# EAGLE design Adaptable AVR Programmer (EAGLE 5.06)
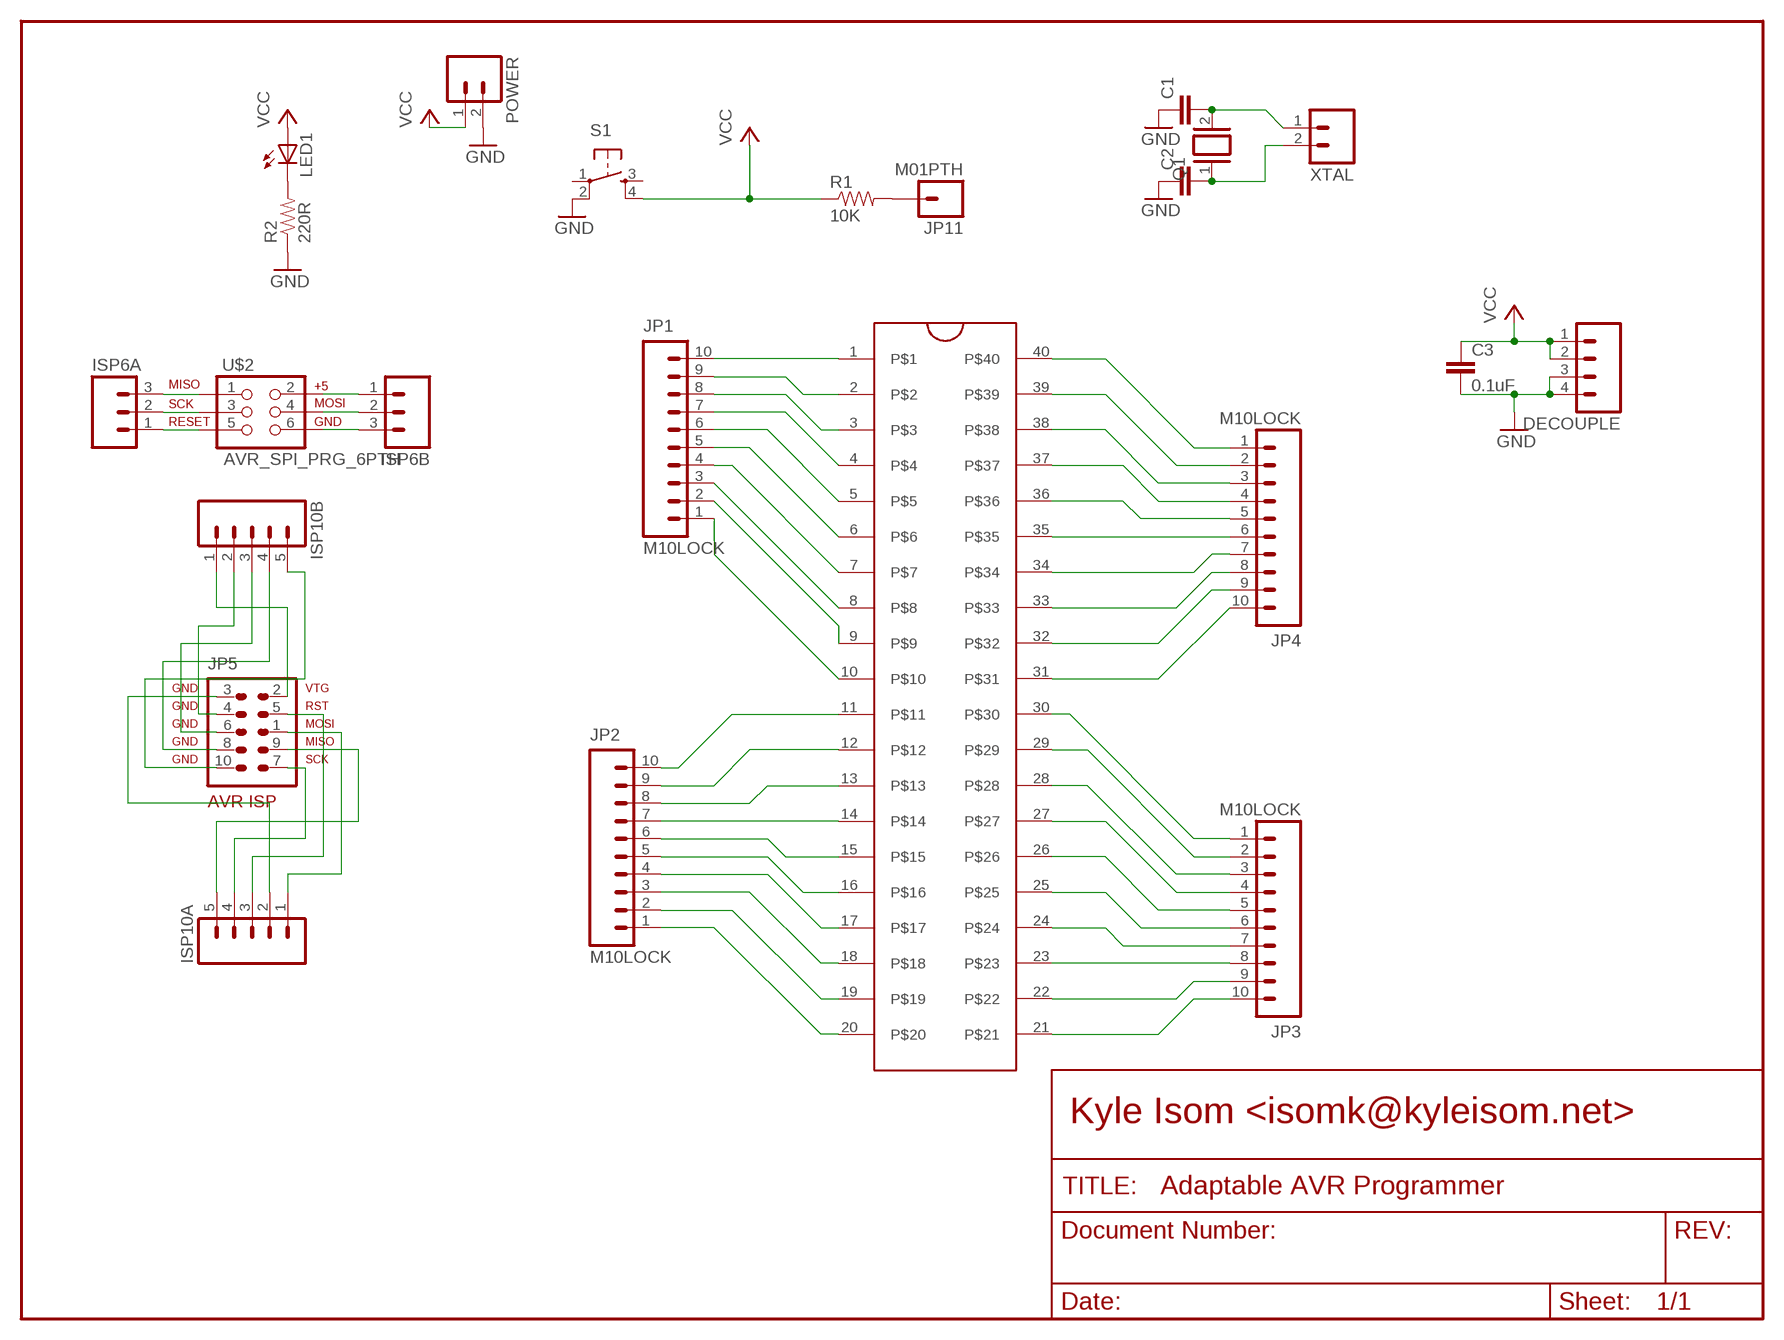
[diagram p0: schematic, sheet 1]

## Parts
C1  CAPPTH1  [CAP-PTH-5MM]
C2  CAPPTH1  [CAP-PTH-5MM]
C3  0.1uF  CAPPTH1  [CAP-PTH-5MM]
DECOUPLE  M04LOCK  [1X04_LOCK]
ISP6A  M03LOCK  [1X03_LOCK]
ISP6B  M03LOCK  [1X03_LOCK]
ISP10A  M05LOCK  [1X05_LOCK]
ISP10B  M05LOCK  [1X05_LOCK]
JP1  M10LOCK  [1X10_LOCK]
JP2  M10LOCK  [1X10_LOCK]
JP3  M10LOCK  [1X10_LOCK]
JP4  M10LOCK  [1X10_LOCK]
JP5  AVR-ISP-10  [AVR-ISP-10]
JP11  M01PTH  [1X01]
LED1  LED3MM  [LED3MM]
POWER  M02LOCK  [1X02_LOCK]
Q1  XTAL/S  [QS]
R1  10K  RESISTORPTH1  [AXIAL-0.3]
R2  220R  RESISTORPTH1  [AXIAL-0.3]
S1  TAC_SWITCHPTH  [TACTILE-PTH]
U$1  ZIFSOCKET-40-6DIL40-6-ZIF_SOCKET  [DIL40-6-ZIF_SOCKET]
U$2  AVR_SPI_PRG_6PTH  [2X3]
XTAL  M02LOCK  [1X02_LOCK]

## Nets
GND: C1.1 C2.1 C3.2 DECOUPLE.3 DECOUPLE.4 POWER.2 R2.P$1 S1.2
N$1: JP1.10 U$1.1
N$2: JP1.9 U$1.2
N$3: JP1.8 U$1.3
N$4: JP1.7 U$1.4
N$5: JP1.6 U$1.5
N$6: JP1.5 U$1.6
N$7: JP1.4 U$1.7
N$8: JP1.3 U$1.8
N$9: JP1.2 U$1.9
N$10: JP1.1 U$1.10
N$11: JP2.10 U$1.11
N$12: JP2.9 U$1.12
N$13: LED1.K(C) R2.P$2
N$14: JP2.8 U$1.13
N$15: JP2.7 U$1.14
N$16: JP2.6 U$1.15
N$17: JP2.5 U$1.16
N$18: JP2.4 U$1.17
N$19: JP2.3 U$1.18
N$20: JP2.2 U$1.19
N$21: JP2.1 U$1.20
N$22: JP3.10 U$1.21
N$23: JP3.9 U$1.22
N$24: JP3.8 U$1.23
N$25: JP3.7 U$1.24
N$26: JP3.6 U$1.25
N$27: JP3.5 U$1.26
N$28: JP3.4 U$1.27
N$29: JP3.3 U$1.28
N$30: JP3.2 U$1.29
N$31: JP3.1 U$1.30
N$32: JP4.10 U$1.31
N$33: JP4.9 U$1.32
N$34: JP4.8 U$1.33
N$35: JP4.7 U$1.34
N$36: JP4.6 U$1.35
N$37: JP4.5 U$1.36
N$38: JP4.4 U$1.37
N$39: JP4.3 U$1.38
N$40: JP4.2 U$1.39
N$41: JP4.1 U$1.40
N$42: ISP6B.1 U$2.2
N$43: ISP6B.2 U$2.4
N$44: ISP6B.3 U$2.6
N$45: ISP6A.1 U$2.5
N$46: ISP6A.2 U$2.3
N$47: ISP6A.3 U$2.1
N$48: ISP10B.1 JP5.2
N$49: ISP10B.2 JP5.4
N$50: ISP10B.3 JP5.6
N$51: ISP10B.4 JP5.8
N$52: ISP10B.5 JP5.10
N$53: ISP10A.1 JP5.1
N$54: ISP10A.2 JP5.3
N$55: JP11.1 R1.P$2
N$57: C1.2 Q1.2 XTAL.1
N$58: C2.2 Q1.1 XTAL.2
N$59: ISP10A.3 JP5.5
N$60: ISP10A.4 JP5.7
N$61: ISP10A.5 JP5.9
VCC: C3.1 DECOUPLE.1 DECOUPLE.2 LED1.A POWER.1 R1.P$1 S1.4
Unconnected: S1.1 S1.3

## Notes on the sheet
- Kyle Isom <isomk@kyleisom.net>

## Library data of the parts
C1-C3 = SparkFun:CAP: Capacitor Standard 0603 ceramic capacitor, and 0.1" leaded capacitor.
DECOUPLE = SparkFun:M04: Header 4 Standard 4-pin 0.1" header. Use with straight break away headers (SKU : PRT-00116), right angle break away headers (PRT-00553), swiss pins (PRT-00743), machine pins (PRT-00117), and female headers (PRT-00115). Molex polarized connector foot print use with SKU : PRT-08231 with associated crimp pins and housings.
ISP6A ISP6B = SparkFun:M03: Header 3 Standard 3-pin 0.1" header. Use with straight break away headers (SKU : PRT-00116), right angle break away headers (PRT-00553), swiss pins (PRT-00743), machine pins (PRT-00117), and female headers (PRT-00115). Molex polarized connector foot print use with SKU : PRT-08232 with associated crimp pins and housings.
ISP10A ISP10B = SparkFun:M05: Header 5 Standard 5-pin 0.1" header. Use with straight break away headers (SKU : PRT-00116), right angle break away headers (PRT-00553), swiss pins (PRT-00743), machine pins (PRT-00117), and female headers (PRT-00115). Molex polarized connector foot print use with SKU : PRT-08230 with associated crimp pins and housings.
JP1-JP4 = SparkFun:M10: Header 10 Standard 10-pin 0.1" header. Use with straight break away headers (SKU : PRT-00116), right angle break away headers (PRT-00553), swiss pins (PRT-00743), machine pins (PRT-00117), and female headers (PRT-00115).
JP5 = avr-6:AVR-ISP-10: AVR ISP-10 Serial Programming Header
JP11 = SparkFun:M01: Header 1 Standard 1-pin 0.1" header. Use with straight break away headers (SKU : PRT-00116), right angle break away headers (PRT-00553), swiss pins (PRT-00743), machine pins (PRT-00117), and female headers (PRT-00115).
LED1 = led:LED: LED OSRAM: - CHIPLED LG R971, LG N971, LY N971, LG Q971, LY Q971, LO R971, LY R971 LH N974, LH R974 LS Q976, LO Q976, LY Q976 LO Q996 - Hyper CHIPLED LW Q18S LB Q993, LB Q99A, LB R99A - SideLED LS A670, LO A670, LY A670, LG A670, LP A670 LB A673, LV A673, LT A673, LW A673 LH A674 LY A675 LS A676, LA A676, LO A676, LY A676, LW A676 LS A679, LY A679, LG A679 - Hyper Micro SIDELED® LS Y876, LA Y876, LO Y876, LY Y876 LT Y87S - SmartLED LW L88C, LW L88S LB L89C, LB L89S, LG L890 LS L89K, LO L89K, LY L89K LS L896, LA L896, LO L896, LY L896 - TOPLED LS T670, LO T670, LY T670, LG T670, LP T670 LSG T670, LSP T670, LSY T670, LOP T670, LYG T670 LG T671, LOG T671, LSG T671 LB T673, LV T673, LT T673, LW T673 LH T674 LS T676, LA T676, LO T676, LY T676, LB T676, LH T676, LSB T676, LW T676 LB T67C, LV T67C, LT T67C, LS T67K, LO T67K, LY T67K, LW E67C LS E67B, LA E67B, LO E67B, LY E67B, LB E67C, LV E67C, LT E67C LW T67C LS T679, LY T679, LG T679 LS T770, LO T770, LY T770, LG T770, LP T770 LB T773, LV T773, LT T773, LW T773 LH T774 LS E675, LA E675, LY E675, LS T675 LS T776, LA T776, LO T776, LY T776, LB T776 LHGB T686 LT T68C, LB T68C - Hyper Mini TOPLED® LB M676 - Mini TOPLED Santana® LG M470 LS M47K, LO M47K, LY M47K Source: http://www.osram.convergy.de LUXEON: - LUMILED® LXK2-PW12-R00, LXK2-PW12-S00, LXK2-PW14-U00, LXK2-PW14-V00 LXK2-PM12-R00, LXK2-PM12-S00, LXK2-PM14-U00 LXK2-PE12-Q00, LXK2-PE12-R00, LXK2-PE12-S00, LXK2-PE14-T00, LXK2-PE14-U00 LXK2-PB12-K00, LXK2-PB12-L00, LXK2-PB12-M00, LXK2-PB14-N00, LXK2-PB14-P00, LXK2-PB14-Q00 LXK2-PR12-L00, LXK2-PR12-M00, LXK2-PR14-Q00, LXK2-PR14-R00 LXK2-PD12-Q00, LXK2-PD12-R00, LXK2-PD12-S00 LXK2-PH12-R00, LXK2-PH12-S00 LXK2-PL12-P00, LXK2-PL12-Q00, LXK2-PL12-R00 Source: www.luxeon.com KINGBRIGHT: KA-3528ASYC Source: www.kingbright.com
POWER XTAL = SparkFun:M02: Header 2 Standard 2-pin 0.1" header. Use with straight break away headers (SKU : PRT-00116), right angle break away headers (PRT-00553), swiss pins (PRT-00743), machine pins (PRT-00117), and female headers (PRT-00115). Molex polarized connector foot print use with SKU : PRT-08233 with associated crimp pins and housings.
Q1 = special:XTAL/S: CRYSTAL
R1 R2 = SparkFun:RESISTOR: Resistor Basic schematic elements and footprints for 0603, 1206, and PTH 1/10th watt (small) resistors.
S1 = SparkFun:TAC_SWITCH: Momentary Switch Button commonly used for reset or general input. Spark Fun Electronics SKU : COM-00097
U$1 = SparkFun:ZIFSOCKET-40-6
U$2 = SparkFun:AVR_SPI_PRG_6: AVR ISP 6 Pin This is the reduced ISP connector for AVR programming. Common on Arduino. This footprint will take up less PCB space and can be used with a 10-pin to 6-pin adapter such as SKU: BOB-08508

## Board
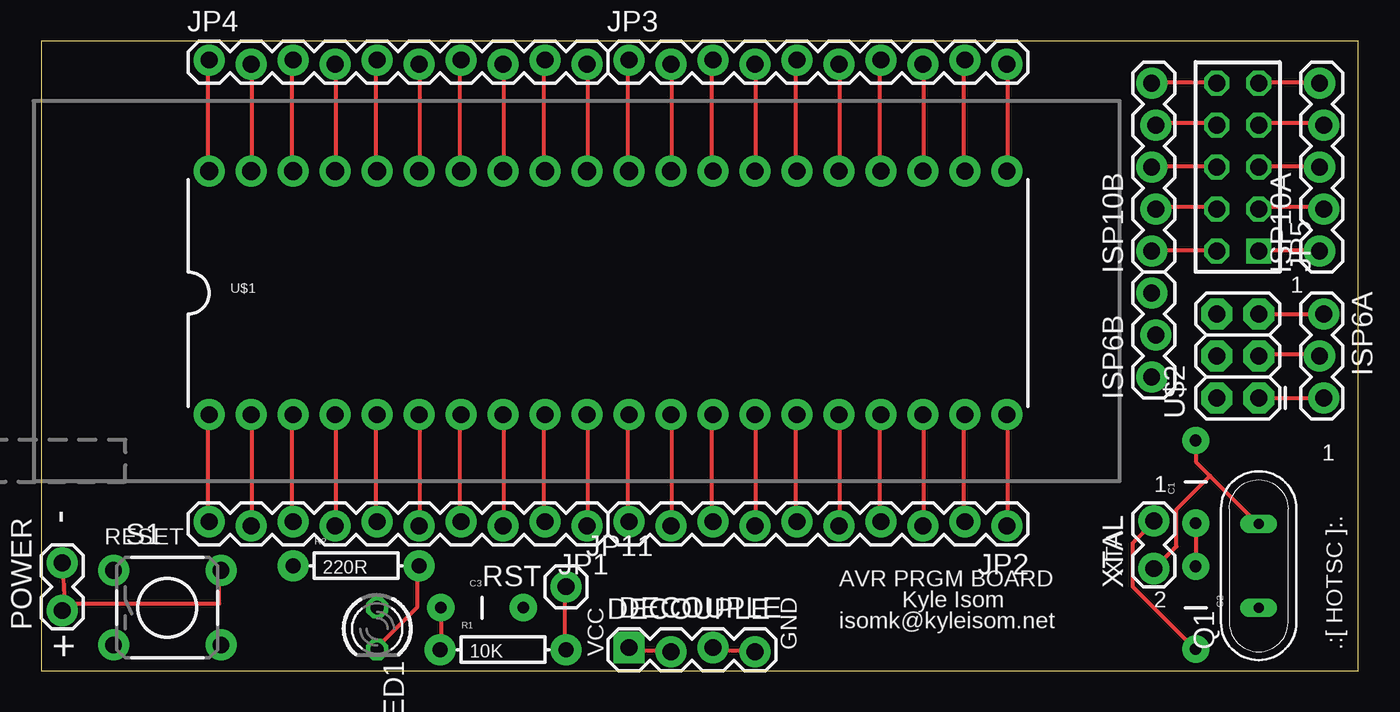
[diagram p1: board, top side]
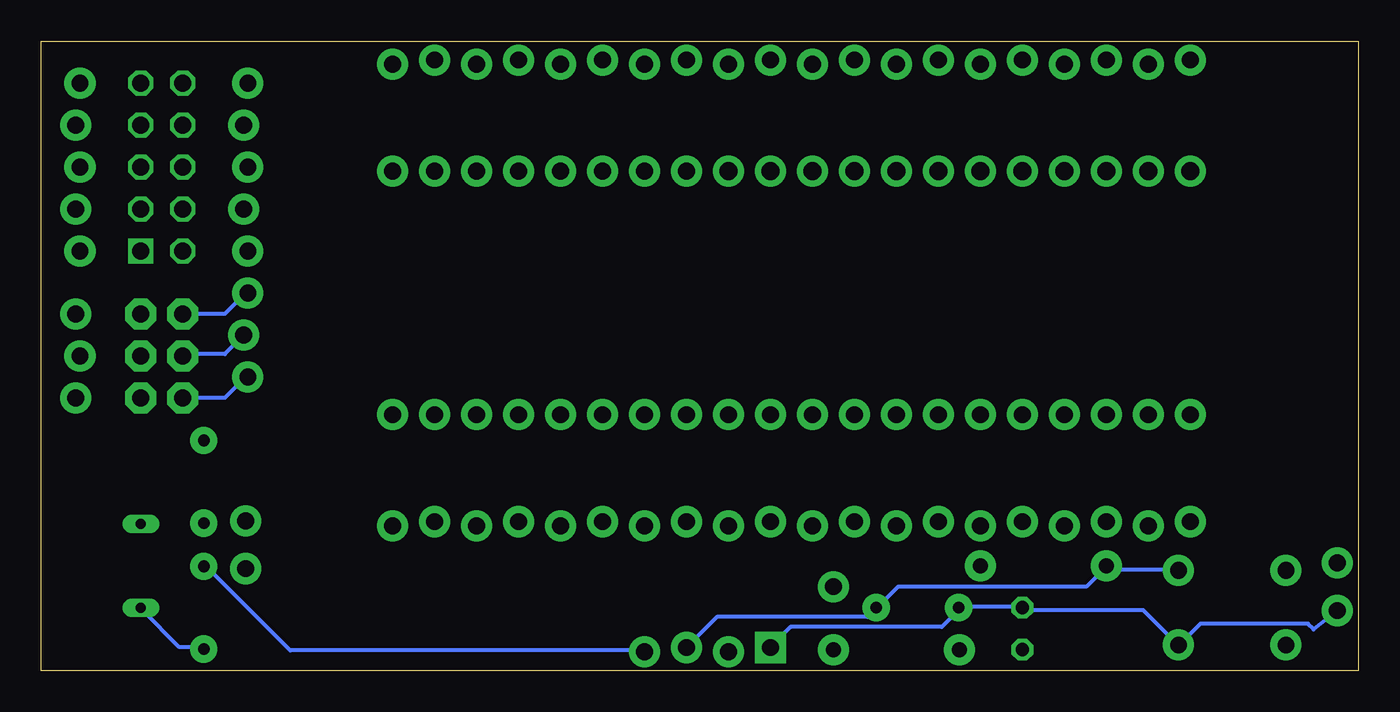
[diagram p2: board, bottom side, seen from below]

Size 79.68 x 38.09 mm. Coordinates in mm from the lower left corner, seen from the top.
Outline: 0,0 79.68,0 79.68,38.09 0,38.09 0,0
Copper layers (1*16): Top 0.035mm / dielectric 1.5mm / Bottom 0.035mm
Design rules "default": minimum track width 10mil, minimum drill 24mil, track to track 8mil, track to pad 8mil, pad to pad 8mil, via to via 8mil, smd to smd 8mil, copper to edge 40mil, drill to drill 8mil, minimum pad ring 10mil, minimum via ring 8mil, stop-mask expansion 4mil, vias tented up to drill 0mil, thermal gap 10mil

### Footprints (pad centres in the part's own frame; a part is rotated, then mirrored left to right if it is on the bottom)
CAP-PTH-5MM = drill 0.7 pad 1.651 round: 1 -2.5,0; 2 2.5,0
1X04_LOCK = drill 1.016 pad 1.88 square: 1 0,0.127 | drill 1.016 pad 1.88 round: 2 2.54,-0.127; 3 5.08,0.127; 4 7.62,-0.127
1X03_LOCK = drill 1.016 pad 1.88 round: 1 0,0.127; 2 2.54,-0.127; 3 5.08,0.127
1X05_LOCK = drill 1.016 pad 1.88 round: 1 0,0.127; 2 2.54,-0.127; 3 5.08,0.127; 4 7.62,-0.127; 5 10.16,0.127
1X10_LOCK = drill 1.016 pad 1.88 round: 1 0,0.127; 2 2.54,-0.127; 3 5.08,0.127; 4 7.62,-0.127; 5 10.16,0.127; 6 12.7,-0.127; 7 15.24,0.127; 8 17.78,-0.127; 9 20.32,0.127; 10 22.86,-0.127
AVR-ISP-10 = drill 1.016 square: 1 -5.08,-1.27 | drill 1.016 octagon: 2 -5.08,1.27; 3 -2.54,-1.27; 4 -2.54,1.27; 5 0,-1.27; 6 0,1.27; 7 2.54,-1.27; 8 2.54,1.27; 9 5.08,-1.27; 10 5.08,1.27
1X01 = drill 1.016 pad 1.88 round: 1 0,0
LED3MM = drill 0.813 octagon: A -1.27,0; K 1.27,0
1X02_LOCK = drill 1.016 pad 1.88 round: 1 -0.178,0; 2 2.718,0
QS = drill 0.61 long: 1 -2.54,0; 2 2.54,0
AXIAL-0.3 = drill 0.9 pad 1.88 round: P$1 -3.81,0; P$2 3.81,0
TACTILE-PTH = drill 1.016 pad 1.88 round: 1 -3.251,2.261; 2 3.251,2.261; 3 -3.251,-2.261; 4 3.251,-2.261
DIL40-6-ZIF_SOCKET = drill 1.016 pad 1.88 round: 1 -24.13,-7.366; 2 -21.59,-7.366; 3 -19.05,-7.366; 4 -16.51,-7.366; 5 -13.97,-7.366; 6 -11.43,-7.366; 7 -8.89,-7.366; 8 -6.35,-7.366; 9 -3.81,-7.366; 10 -1.27,-7.366; 11 1.27,-7.366; 12 3.81,-7.366; 13 6.35,-7.366; 14 8.89,-7.366; 15 11.43,-7.366; 16 13.97,-7.366; 17 16.51,-7.366; 18 19.05,-7.366; 19 21.59,-7.366; 20 24.13,-7.366; 21 24.13,7.366; 22 21.59,7.366; 23 19.05,7.366; 24 16.51,7.366; 25 13.97,7.366; 26 11.43,7.366; 27 8.89,7.366; 28 6.35,7.366 | drill 1.1 pad 1.88 round: 29 3.81,7.366; 30 1.27,7.366; 31 -1.27,7.366; 32 -3.81,7.366; 33 -6.35,7.366; 34 -8.89,7.366; 35 -11.43,7.366; 36 -13.97,7.366; 37 -16.51,7.366; 38 -19.05,7.366; 39 -21.59,7.366; 40 -24.13,7.366
2X3 = drill 1.016 pad 1.88 octagon: 1 0,0; 2 0,2.54; 3 2.54,0; 4 2.54,2.54; 5 5.08,0; 6 5.08,2.54

### Placement (x,y rotation side)
C1  69.85,11.43 90 top
C2  69.85,3.81 270 top
C3  26.67,3.81 0 top
DECOUPLE  35.56,1.27 0 top
ISP6A  77.47,21.59 270 top
ISP6B  67.31,17.78 90 top
ISP10A  77.47,25.4 90 top
ISP10B  67.31,25.4 90 top
JP1  33.02,8.89 180 top
JP2  58.42,8.89 180 top
JP3  35.56,36.83 0 top
JP4  10.16,36.83 0 top
JP5  72.39,30.48 90 top
JP11  31.75,5.08 0 top
LED1  20.32,2.54 270 top
POWER  1.27,3.81 90 top
Q1  73.66,6.35 90 top
R1  27.94,1.27 0 top
R2  19.05,6.35 0 top
S1  7.62,3.81 0 top
U$1  34.29,22.86 0 top
U$2  73.66,16.51 90 top
XTAL  67.31,6.35 90 top

### Tracks (layer width: path | path; a pad name or v marks a point on that pad's centre or on a via)
GND
  Top 0.254: POWER.2 1.42,4.06 10.77,4.06 10.77,5.89 S1.2 | C2.1 69.9,6.5 69.9,8.74 C1.1 | DECOUPLE.4 43.08,1.22 40.64,1.22 DECOUPLE.3
  Bottom 0.254: 15.24,6.3 15.04,6.1 10.97,6.1 S1.2 | DECOUPLE.3 40.64,1.42 38.81,3.25 29.67,3.25 29.26,3.66 C3.2 29.06,3.86 27.84,5.08 16.46,5.08 15.24,6.3 | C2.1 69.7,6.3 64.62,1.22 43.28,1.22 DECOUPLE.4 | 15.24,6.3 R2.P$1
N$1
  Top 0.254: JP1.10 10.11,9.14 10.11,15.39 U$1.1
N$2
  Top 0.254: JP1.9 12.75,8.94 12.75,15.39 U$1.2
N$3
  Top 0.254: JP1.8 15.19,9.14 15.19,15.39 U$1.3
N$4
  Top 0.254: JP1.7 17.83,8.94 17.83,15.39 U$1.4
N$5
  Top 0.254: JP1.6 20.27,9.14 20.27,15.39 U$1.5
N$6
  Top 0.254: JP1.5 22.91,8.94 22.91,15.39 U$1.6
N$7
  Top 0.254: JP1.4 25.35,9.14 25.35,15.39 U$1.7
N$8
  Top 0.254: JP1.3 27.99,8.94 27.99,15.39 U$1.8
N$9
  Top 0.254: JP1.2 30.43,9.14 30.43,15.39 U$1.9
N$10
  Top 0.254: JP1.1 33.07,8.94 33.07,15.39 U$1.10
N$11
  Top 0.254: JP2.10 35.51,9.14 35.51,15.39 U$1.11
N$12
  Top 0.254: JP2.9 38.15,8.94 38.15,15.39 U$1.12
N$13
  Top 0.254: LED1.K 20.32,1.42 22.76,3.86 22.76,6.3 R2.P$2
N$14
  Top 0.254: JP2.8 40.59,9.14 40.59,15.39 U$1.13
N$15
  Top 0.254: JP2.7 43.23,8.94 43.23,15.39 U$1.14
N$16
  Top 0.254: JP2.6 45.67,9.14 45.67,15.39 U$1.15
N$17
  Top 0.254: JP2.5 48.31,8.94 48.31,15.39 U$1.16
N$18
  Top 0.254: JP2.4 50.75,9.14 50.75,15.39 U$1.17
N$19
  Top 0.254: JP2.3 53.39,8.94 53.39,15.39 U$1.18
N$20
  Top 0.254: JP2.2 55.83,9.14 55.83,15.39 U$1.19
N$21
  Top 0.254: JP2.1 58.47,8.94 58.47,15.39 U$1.20
N$22
  Top 0.254: U$1.21 58.47,30.23 58.47,36.68 JP3.10
N$23
  Top 0.254: U$1.22 55.83,30.23 55.83,36.88 JP3.9
N$24
  Top 0.254: U$1.23 53.39,30.23 53.39,36.68 JP3.8
N$25
  Top 0.254: U$1.24 50.75,30.23 50.75,36.88 JP3.7
N$26
  Top 0.254: U$1.25 48.31,30.23 48.31,36.68 JP3.6
N$27
  Top 0.254: U$1.26 45.67,30.23 45.67,36.88 JP3.5
N$28
  Top 0.254: U$1.27 43.23,30.23 43.23,36.68 JP3.4
N$29
  Top 0.254: U$1.28 40.59,30.23 40.59,36.88 JP3.3
N$30
  Top 0.254: U$1.29 38.15,30.23 38.15,36.68 JP3.2
N$31
  Top 0.254: U$1.30 35.51,30.23 35.51,36.88 JP3.1
N$32
  Top 0.254: U$1.31 33.07,30.23 33.07,36.68 JP4.10
N$33
  Top 0.254: U$1.32 30.43,30.23 30.43,36.88 JP4.9
N$34
  Top 0.254: U$1.33 27.99,30.23 27.99,36.68 JP4.8
N$35
  Top 0.254: U$1.34 25.35,30.23 25.35,36.88 JP4.7
N$36
  Top 0.254: U$1.35 22.91,30.23 22.91,36.68 JP4.6
N$37
  Top 0.254: U$1.36 20.27,30.23 20.27,36.88 JP4.5
N$38
  Top 0.254: U$1.37 17.83,30.23 17.83,36.68 JP4.4
N$39
  Top 0.254: U$1.38 15.19,30.23 15.19,36.88 JP4.3
N$40
  Top 0.254: U$1.39 12.75,30.23 12.75,36.68 JP4.2
N$41
  Top 0.254: U$1.40 10.11,30.23 10.11,36.88 JP4.1
N$42
  Bottom 0.254: ISP6B.1 67.36,17.73 68.58,16.51 U$2.2
N$43
  Bottom 0.254: ISP6B.2 67.56,20.17 68.58,19.15 71.02,19.15 U$2.4
N$44
  Bottom 0.254: ISP6B.3 67.36,22.81 68.58,21.59 U$2.6
N$45
  Top 0.254: U$2.5 ISP6A.1
N$46
  Top 0.254: U$2.3 73.66,19.15 77.32,19.15 ISP6A.2
N$47
  Top 0.254: U$2.1 ISP6A.3
N$48
  Top 0.254: JP5.2 71.02,25.45 67.36,25.45 ISP10B.1
N$49
  Top 0.254: JP5.4 71.02,28.09 67.56,28.09 ISP10B.2
N$50
  Top 0.254: JP5.6 71.02,30.53 67.36,30.53 ISP10B.3
N$51
  Top 0.254: JP5.8 71.02,33.17 67.56,33.17 ISP10B.4
N$52
  Top 0.254: JP5.10 71.02,35.61 67.36,35.61 ISP10B.5
N$53
  Top 0.254: JP5.1 73.66,25.45 77.32,25.45 ISP10A.1
N$54
  Top 0.254: JP5.3 73.66,28.09 77.52,28.09 ISP10A.2
N$55
  Top 0.254: R1.P$2 31.7,1.42 31.7,5.08 JP11.1
N$57
  Top 0.254: 70.71,11.79 69.9,12.6 69.9,13.82 C1.2 | 70.71,11.79 73.56,8.94 Q1.2 | 70.71,11.79 68.68,9.75 68.68,7.52 67.46,6.3 XTAL.1
N$58
  Top 0.254: XTAL.2 67.26,8.94 66.04,7.72 66.04,5.08 69.7,1.42 C2.2
  Bottom 0.254: Q1.1 73.56,3.66 71.32,1.42 69.9,1.42 C2.2
N$59
  Top 0.254: JP5.5 73.66,30.53 77.32,30.53 ISP10A.3
N$60
  Top 0.254: JP5.7 73.66,33.17 77.52,33.17 ISP10A.4
N$61
  Top 0.254: JP5.9 73.66,35.61 77.32,35.61 ISP10A.5
VCC
  Top 0.254: DECOUPLE.1 35.56,1.22 38,1.22 DECOUPLE.2 | R1.P$1 24.18,1.42 24.18,3.66 C3.1
  Bottom 0.254: POWER.1 2.69,2.49 3.05,2.85 9.55,2.85 10.77,1.63 S1.4 10.97,1.63 13.01,3.66 20.32,3.66 LED1.A 20.32,3.86 23.98,3.86 C3.1 24.18,3.66 25.2,2.64 34.34,2.64 35.56,1.42 DECOUPLE.1

### Text on the board
tPlace: 1 | 1 | 1 | - | RESET | XTAL | RST | AVR PRGM BOARD | VCC | Kyle Isom | 2 | DECOUPLE | isomk@kyleisom.net | + | GND | .:[ HOTSC ]:.